# Altium project Electronics Multi Oscillator.PrjPcb
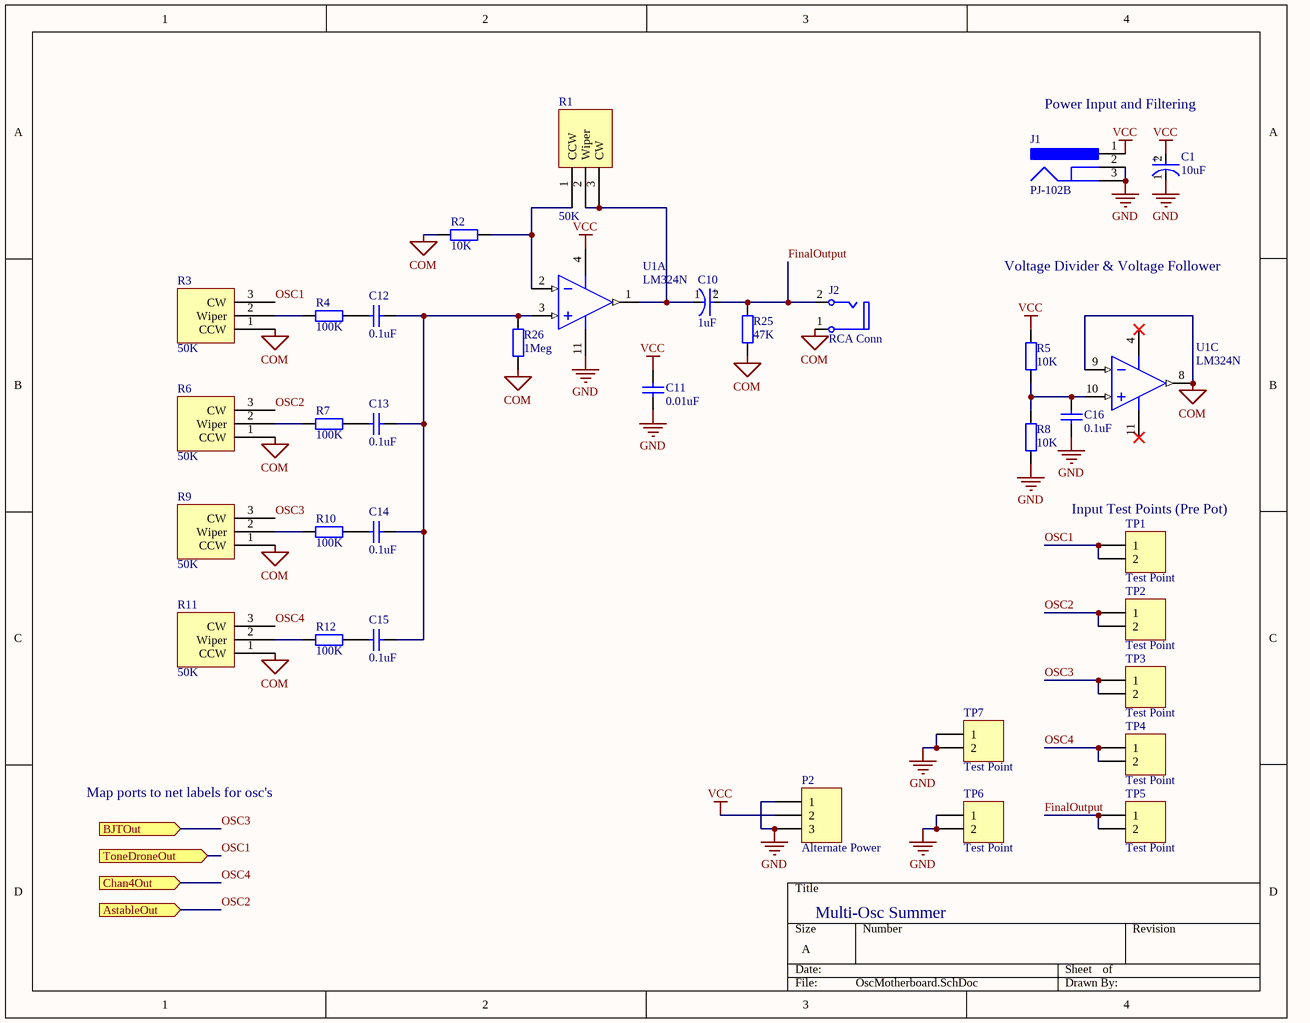
[diagram p0: OscMotherboard.SchDoc]
5 sheets, 63 parts. Net scope: flat (ports and power ports of the same name join across sheets).
Board files: MultiOsc.PcbDoc, MilledPCB.PcbDoc, FinalPCB.PcbDoc
Sheets:
  OscMotherboard.SchDoc
  ToneDroneOsc.SchDoc
  AstableMultivibrator.SchDoc
  BjtPhaseShiftOsc.SchDoc
  PerfBoard.SchDoc

## Sheet OscMotherboard.SchDoc
size A; SheetNumber: 1; SheetTotal: 5

### Parts
C1  10uF  [FP-ESLE3-MFG]
C10  1uF  [FP-ESLE3-MFG]
C11  0.01uF  [KEMT-C315-THT-2]
C12  0.1uF  [KEMT-C315-THT-2]
C13  0.1uF  [KEMT-C315-THT-2]
C14  0.1uF  [KEMT-C315-THT-2]
C15  0.1uF  [KEMT-C315-THT-2]
C16  0.1uF  [KEMT-C315-THT-2]
J1  PJ-102B  [CUI-PJ-102B_V]
J2  RCA Conn  [CUI-RCJ-041_V]
P2  Alternate Power  [HDR1X3]
R1  50K  [TrimmerPot]
R2  10K  [AXIAL-0.4]
R3  50K  [TrimmerPot]
R4  100K  [AXIAL-0.4]
R5  10K  [AXIAL-0.4]
R6  50K  [TrimmerPot]
R7  100K  [AXIAL-0.4]
R8  10K  [AXIAL-0.4]
R9  50K  [TrimmerPot]
R10  100K  [AXIAL-0.4]
R11  50K  [TrimmerPot]
R12  100K  [AXIAL-0.4]
R25  47K  [AXIAL-0.4]
R26  1Meg  [AXIAL-0.4]
TP1  Test Point  [HDR1X2]
TP2  Test Point  [HDR1X2]
TP3  Test Point  [HDR1X2]
TP4  Test Point  [HDR1X2]
TP5  Test Point  [HDR1X2]
TP6  Test Point  [HDR1X2]
TP7  Test Point  [HDR1X2]
U1  LM324N  [N0014A]  (parts A,C of 4)

### Ports
AstableOut (in), BJTOut (in), Chan4Out (in), ToneDroneOut (in)

### Nets
COM: J2.1 R2.2 R3.1(CCW) R6.1(CCW) R9.1(CCW) R11.1(CCW) R25.2 R26.2 U1.8(OUT3) U1.9(IN3-)
GND: C1.1(C) C11.2 C16.2 J1.2 J1.3 P2.1 P2.3 R8.2 TP6.1 TP6.2 TP7.1 TP7.2 U1.11(GND)
VCC: C1.2(A) C11.1 J1.1 P2.2 R5.1 U1.4(V+)
FinalOutput: C10.2(A) J2.2 R25.1 TP5.1 TP5.2
OSC1: R3.3(CW) TP1.1 TP1.2 ; port ToneDroneOut
OSC2: R6.3(CW) TP2.1 TP2.2 ; port AstableOut
OSC3: R9.3(CW) TP3.1 TP3.2 ; port BJTOut
OSC4: R11.3(CW) TP4.1 TP4.2 ; port Chan4Out
NetC10_1: C10.1(C) R1.2(Wiper) R1.3(CW) U1.1(OUT1)
NetC12_1: C12.1 C13.1 C14.1 C15.1 R26.1 U1.3(IN1+)
NetC12_2: C12.2 R4.1
NetC13_2: C13.2 R7.1
NetC14_2: C14.2 R10.1
NetC15_2: C15.2 R12.1
NetC16_1: C16.1 R5.2 R8.1 U1.10(IN3+)
NetR1_1: R1.1(CCW) R2.1 U1.2(IN1-)
NetR3_2: R3.2(Wiper) R4.2
NetR6_2: R6.2(Wiper) R7.2
NetR9_2: R9.2(Wiper) R10.2
NetR11_2: R11.2(Wiper) R12.2

### Notes on the sheet
- Power Input and Filtering
- Voltage Divider & Voltage Follower
- (near TP1) Input Test Points (Pre Pot)
- Map ports to net labels for osc's
- Multi-Osc Summer
- (in symbol CMP-03015-000004-1) +

### Library data of the parts
C1 C10 = CMP-03015-000004-1: CAP ALUM 10UF 20% 100V THRU HOLE; Manufacturer Part Number: ESL106M100AE3AA; Manufacturer: kemet; Life: 10000Hours; Ripple Current: 280mA; Dissipation Factor: 9%; Esr: 0.68Ω; Leakage Current: 10uA; Material: Aluminum; Tolerance: 20%; Voltage Rating: 100V; Device Class L3: Aluminum Electrolytic Capacitors; Value: 10uF; Height: 12.5mm; Temperature Range High: +105°C; Capacitance: 10uF; ComponentLink2Description: Datasheet; Mouser Description: Cap, 10UF, 100V, Alu Elec, Radial; Category: Cap; Octopart: https://octopart.com/esl106m100ae3aa-kemet-84758885; Temperature: -40°C to +105°C; RoHS: TRUE; Device Class L1: Passive Components; Digikey Description: CAP ALUM 10UF 20% 100V THRU HOLE; ComponentLink2URL: https://content.kemet.com/datasheets/KEM_A4074_ESL.pdf; Device Class L2: Capacitors; Temperature Range Low: -40°C; Package: ESLE3; Automotive: No; Lead Free: Yes
C11-C16 = CMP-1664-00007-1: Capacitor, Ceramic, 0.01 uF, +/- 10%, 100 V, X7R, -55 to 125 degC, 2-Pin THD, RoHS, Bulk; Output Voltage: 70 V; Case\Package: PDIP; Forward Current: 60 mA; Nominal Vf: 1.3 V; Forward Voltage: 1.5 V; Channels: 2; Max Power Dissipation: 400 mW; Vce Max: 500 mV; ComponentLink1Description: Manufacturer URL; ComponentLink2Description: Datasheet; Packaging: Rail/Tube; RoHSCompliant: true; Package Quantity: 2000; PackageReference: C315-THT-2; Min Operating Temperature: -55 degC; Max Operating Temperature: 100 degC; Radiation Hardening: No; ComponentLink1URL: http://www.kemet.com/; DatasheetVersion: Aug-16; Pins: 16; PackageDescription: 2-Pin Through Hole Device, Body 3.81 x 2.54 mm; REACH SVHC: Unknown; Mount: Through Hole; ComponentLink2URL: http://capacitoredge.kemet.com/capedge2/DataSheet/Datasheet-C315C103K1R5TA.pdf?pn=C315C103K1R5TA{BULK}
J1 = CMP-2000-06900-1: Through Hole Right Angle DC Power Jack, 2.5 A, 2.5 mm Center Pin, 3 Position, -25 to 85 degC, RoHS, Bulk; Manufacturer: CUIInc.; Insulation Resistance: 100MOhms; Inside Contact Diameter: 2.5mm; Outside Contact Diameter: 6.5mm; Voltage Rating: 24V; Current Rating: 2.5A; Brand: CUI; Datasheet URL: http://www.cui.com/product/resource/pj-102b.pdf; Housing Material: PolybutyleneTerephthalate(PBT); Operating Temperature Range: -25Cto+85C; Package Reference: PJ-102B; Factory Pack Quantity: 280; RoHS: True; Contact Material: Copper; Datasheet Version: Rev. 1.03, 04/2016; Product: Jacks; Mounting Angle: Right; Mounting Style: ThroughHole; Flammability Rating: UL94V-0; Product Category: DCPowerConnectors; Contact Gender: Male; Termination Style: ThroughHole; Manufacturer URL: http://www.cui.com/; Mounting Technology: ThroughHole; Package Description: 3-Pin Through Hole Device, Body 14.4 x 9 mm, Height 11 mm; Contact Plating: Nickel; Packaging: Bulk; Connector Type: DCPowerJack
J2 = CMP-1692-00002-1: Female RCJ Jack, 2 Position, Height 11.724 mm, Tail Length 4 mm, RoHS, Bulk; Case\Package: Metal; Connector Type: HDMI; Current Rating: 500 mA; Voltage Rating: 40 V; Length: 16.2 mm; Pins: 19; ComponentLink1URL: http://www.cui.com/; ComponentLink1Description: Manufacturer URL; Packaging: Tape and Reel; Lead Pitch: 0.5 mm; PackageDescription: Female RCJ Jack, 2 Position, Height 11.724 mm, Tail Length 4 mm; RoHSCompliant: true; Min Operating Temperature: -55 degC; Height: 6.1 mm; Contact Material: Copper; REACH SVHC: No SVHC; DatasheetVersion: Rev. B, 02/2012; ComponentLink2Description: Datasheet; Contact Plating: Gold; Colour: Black; Max Operating Temperature: 85 degC; Mount: Surface Mount; Package Quantity: 400; Gender: Female; ComponentLink2URL: http://www.cui.com/product/resource/rcj-04x.pdf; PackageReference: RCJ-041
P2 = Header 3: Header, 3-Pin; LatestRevisionDate: 17-Jul-2002; LatestRevisionNote: Re-released for DXP Platform.; Publisher: Altium Limited
R1 R3 R6 R9 R11 = TrimmerPot
R2 R4 R5 R7 R8 R10 R12 R25 R26 = Res2: Resistor; Value: 1K; Published: 8-Jun-2000; LatestRevisionDate: 17-Jul-2002; LatestRevisionNote: Re-released for DXP Platform.; PackageReference: AXIAL-0.4; Publisher: Altium Limited; PackageDescription: Axial Device, Thru-Hole; 2 Leads; 0.4 in Pin Spacing
TP1-TP7 = Header 2: Header, 2-Pin; LatestRevisionDate: 17-Jul-2002; LatestRevisionNote: Re-released for DXP Platform.; Publisher: Altium Limited
U1 = CMP-0055-00082-3: Low Power Quad Operational Amplifier, 14-pin MDIP; Manufacturer: Texas Instruments; CompType: Amplifiers; PowerWise: N; PackageTopMarking: NSUZXYYTTE#*LM324N; PackageDescription: MDIP, .750 x .250 x.130in, 14 Lead, .100in Pitch; Package Reference: N0014A; RoHS: N; Code_JEDEC: MS-001-AA; ComponentLink1URL: http://www.ti.com/general/docs/lit/getliterature.tsp?genericPartNumber=LM324&fileType=pdf; ComponentLink1Description: Datasheet URL; PinCount: 14

## Sheet ToneDroneOsc.SchDoc
size A; SheetNumber: 2; SheetTotal: 5
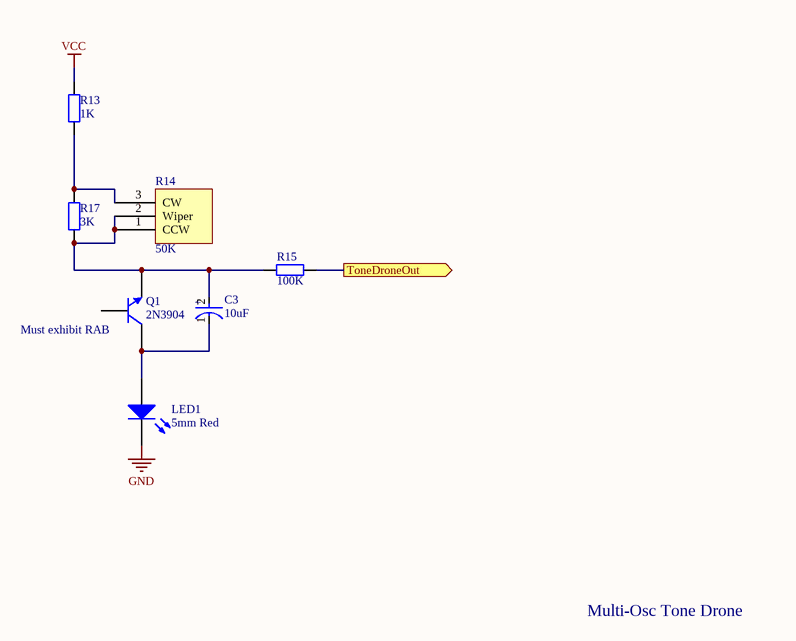
[diagram p1: ToneDroneOsc.SchDoc]

### Parts
C3  10uF  [FP-ESLE3-MFG]
LED1  5mm Red  [Type 5mm]
Q1  2N3904  [TO-92A]
R13  1K  [AXIAL-0.4]
R14  50K  [TrimmerPot]
R15  100K  [AXIAL-0.4]
R17  3K  [AXIAL-0.4]

### Ports
ToneDroneOut (out)

### Nets
GND: LED1.1(K)
VCC: R13.2
OSC1: R15.1 ; port ToneDroneOut
NetC3_1: C3.1(C) LED1.2(A) Q1.3(C)
NetC3_2: C3.2(A) Q1.1(E) R14.1(CCW) R14.2(Wiper) R15.2 R17.1
NetR13_1: R13.1 R14.3(CW) R17.2

Not connected (* = marked no-connect by the designer): Q1 2(B)

### Notes on the sheet
- (near Q1) Must exhibit RAB
- Multi-Osc Tone Drone
- (in symbol CMP-03015-000004-1) +

### Library data of the parts
C3 = CMP-03015-000004-1: as C1 on sheet OscMotherboard; Tolerance: 20%; Voltage Rating: 100V; Device Class L3: Aluminum Electrolytic Capacitors; Value: 10uF; Height: 12.5mm; Temperature Range High: +105°C; Capacitance: 10uF; ComponentLink2Description: Datasheet; Mouser Description: Cap, 10UF, 100V, Alu Elec, Radial; Category: Cap; Octopart: https://octopart.com/esl106m100ae3aa-kemet-84758885; Temperature: -40°C to +105°C; RoHS: TRUE; Device Class L1: Passive Components; Digikey Description: CAP ALUM 10UF 20% 100V THRU HOLE; ComponentLink2URL: https://content.kemet.com/datasheets/KEM_A4074_ESL.pdf; Device Class L2: Capacitors; Temperature Range Low: -40°C; Package: ESLE3; Automotive: No; Lead Free: Yes
LED1 = CMP-1488-00008-1: THT LED round mono-color color lens, WL-TMRW, Red; PartNumber: 151051RS11000; Manufacturer: Wuerth Elektronik; PackageReference: Type 5mm; ComponentLink2URL: http://katalog.we-online.de/pbs/datasheet/7448042001.pdfhttp://katalog.we-online.de/pbs/datasheet/7448042001.pdfhttp://katalog.we-online.de/pbs/datasheet/7448042001.pdfhttp://katalog.we-online.de/pbs/datasheet/151051RS11000.pdf; ComponentLink1URL: http://www.we-online.com; ComponentLink1Description: Manufacturer URL; ComponentLink2Description: Datasheet; Emitting color: Red
Q1 = 2N3904: NPN General Purpose Amplifier; Published: 8-Jun-2000; LatestRevisionDate: 15-Jan-2003; LatestRevisionNote: PCB Footprint 'BCY-W3/D4.7' replaced; DatasheetVersion: 1997; PackageVersion: Sep-1998; PackageReference: TO-92A; Publisher: Altium Limited; PackageDescription: TO, Flat Index; 3 In-Line, Axial Leads; Body Dia. 4.5mm; Leads 0.51 x 0.48 mm (max); ComponentLink1Description: Manufacturer Link; ComponentLink1URL: http://www.fairchildsemi.com/; ComponentLink2Description: Datasheet; ComponentLink2URL: http://www.fairchildsemi.com/ds/2N%2F2N3904.pdf
R13 R15 = Res2: Resistor; Published: 8-Jun-2000; LatestRevisionDate: 17-Jul-2002; LatestRevisionNote: Re-released for DXP Platform.; PackageReference: AXIAL-0.4; Publisher: Altium Limited; PackageDescription: Axial Device, Thru-Hole; 2 Leads; 0.4 in Pin Spacing
  R13: Value: 1K
  R15: Value: 100K
R14 = TrimmerPot
R17 = Res2: Resistor; Value: 1K; Published: 8-Jun-2000; LatestRevisionDate: 17-Jul-2002; LatestRevisionNote: Re-released for DXP Platform.; PackageReference: AXIAL-0.4; Publisher: Altium Limited; PackageDescription: Axial Device, Thru-Hole; 2 Leads; 0.4 in Pin Spacing

## Sheet AstableMultivibrator.SchDoc
size A; SheetNumber: 3; SheetTotal: 5
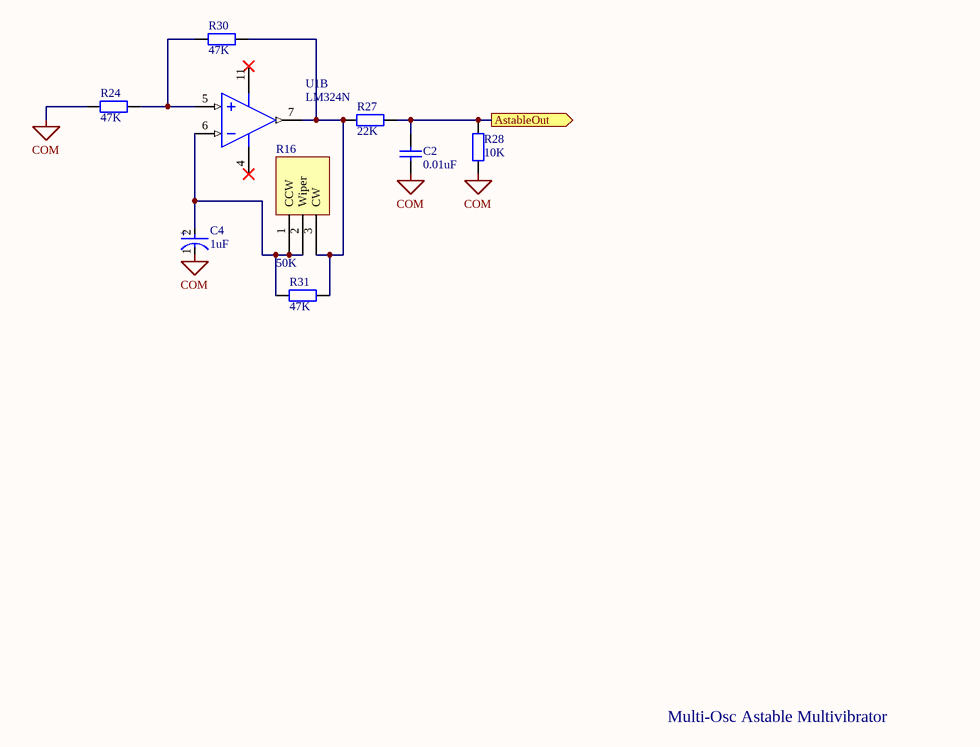
[diagram p2: AstableMultivibrator.SchDoc]

### Parts
C2  0.01uF  [KEMT-C315-THT-2]
C4  1uF  [FP-ESLE3-MFG]
R16  50K  [TrimmerPot]
R24  47K  [AXIAL-0.4]
R27  22K  [AXIAL-0.4]
R28  10K  [AXIAL-0.4]
R30  47K  [AXIAL-0.4]
R31  47K  [AXIAL-0.4]
U1  LM324N  [N0014A]  (part B of 4)

### Ports
AstableOut (out)

### Nets
COM: C2.2 C4.1(C) R24.1 R28.2
GND: U1.11(GND)
VCC: U1.4(V+)
OSC2: C2.1 R27.2 R28.1 ; port AstableOut
NetC4_2: C4.2(A) R16.1(CCW) R16.2(Wiper) R31.2 U1.6(IN2-)
NetR16_3: R16.3(CW) R27.1 R30.1 R31.1 U1.7(OUT2)
NetR24_2: R24.2 R30.2 U1.5(IN2+)

### Notes on the sheet
- Multi-Osc Astable Multivibrator
- (in symbol CMP-03015-000004-1) +

### Library data of the parts
C2 = CMP-1664-00007-1: as C11 on sheet OscMotherboard; ComponentLink1Description: Manufacturer URL; ComponentLink2Description: Datasheet; Packaging: Rail/Tube; RoHSCompliant: true; Package Quantity: 2000; PackageReference: C315-THT-2; Min Operating Temperature: -55 degC; Max Operating Temperature: 100 degC; Radiation Hardening: No; ComponentLink1URL: http://www.kemet.com/; DatasheetVersion: Aug-16; Pins: 16; PackageDescription: 2-Pin Through Hole Device, Body 3.81 x 2.54 mm; REACH SVHC: Unknown; Mount: Through Hole; ComponentLink2URL: http://capacitoredge.kemet.com/capedge2/DataSheet/Datasheet-C315C103K1R5TA.pdf?pn=C315C103K1R5TA{BULK}
C4 = CMP-03015-000004-1: as C1 on sheet OscMotherboard; Tolerance: 20%; Voltage Rating: 100V; Device Class L3: Aluminum Electrolytic Capacitors; Value: 10uF; Height: 12.5mm; Temperature Range High: +105°C; Capacitance: 10uF; ComponentLink2Description: Datasheet; Mouser Description: Cap, 10UF, 100V, Alu Elec, Radial; Category: Cap; Octopart: https://octopart.com/esl106m100ae3aa-kemet-84758885; Temperature: -40°C to +105°C; RoHS: TRUE; Device Class L1: Passive Components; Digikey Description: CAP ALUM 10UF 20% 100V THRU HOLE; ComponentLink2URL: https://content.kemet.com/datasheets/KEM_A4074_ESL.pdf; Device Class L2: Capacitors; Temperature Range Low: -40°C; Package: ESLE3; Automotive: No; Lead Free: Yes
R16 = TrimmerPot
R24 R27 R28 R30 R31 = Res2: Resistor; Value: 1K; Published: 8-Jun-2000; LatestRevisionDate: 17-Jul-2002; LatestRevisionNote: Re-released for DXP Platform.; PackageReference: AXIAL-0.4; Publisher: Altium Limited; PackageDescription: Axial Device, Thru-Hole; 2 Leads; 0.4 in Pin Spacing
U1 = CMP-0055-00082-3: as U1 on sheet OscMotherboard; PackageDescription: MDIP, .750 x .250 x.130in, 14 Lead, .100in Pitch; Package Reference: N0014A; RoHS: N; Code_JEDEC: MS-001-AA; ComponentLink1URL: http://www.ti.com/general/docs/lit/getliterature.tsp?genericPartNumber=LM324&fileType=pdf; ComponentLink1Description: Datasheet URL; PinCount: 14

## Sheet BjtPhaseShiftOsc.SchDoc
size A; SheetNumber: 4; SheetTotal: 5
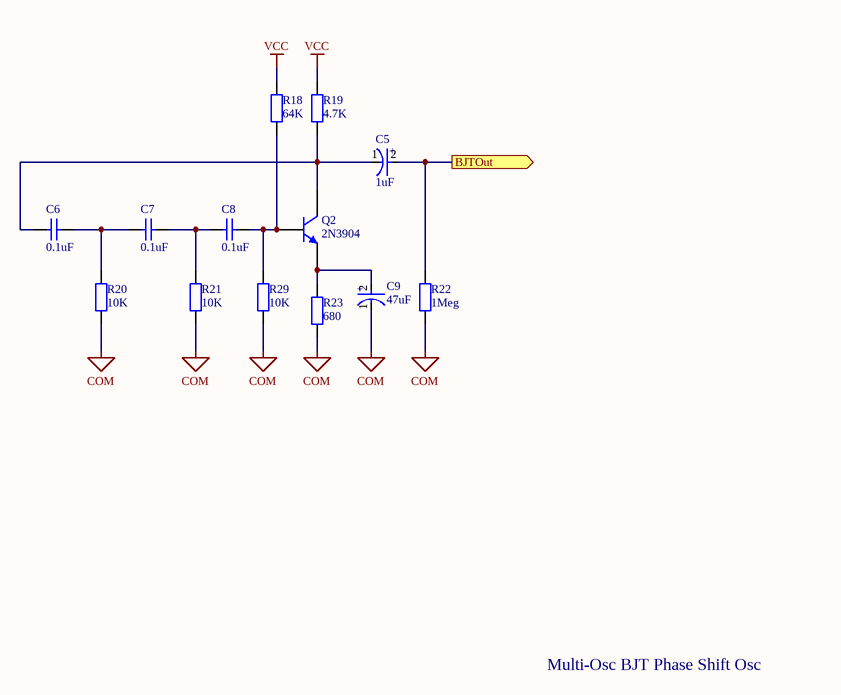
[diagram p3: BjtPhaseShiftOsc.SchDoc]

### Parts
C5  1uF  [FP-ESLE3-MFG]
C6  0.1uF  [KEMT-C315-THT-2]
C7  0.1uF  [KEMT-C315-THT-2]
C8  0.1uF  [KEMT-C315-THT-2]
C9  47uF  [FP-ESLE3-MFG]
Q2  2N3904  [TO-92A]
R18  64K  [AXIAL-0.4]
R19  4.7K  [AXIAL-0.4]
R20  10K  [AXIAL-0.4]
R21  10K  [AXIAL-0.4]
R22  1Meg  [AXIAL-0.4]
R23  680  [AXIAL-0.4]
R29  10K  [AXIAL-0.4]

### Ports
BJTOut (out)

### Nets
COM: C9.1(C) R20.2 R21.2 R22.2 R23.2 R29.2
VCC: R18.2 R19.1
OSC3: C5.2(A) R22.1 ; port BJTOut
NetC5_1: C5.1(C) C6.2 Q2.3(C) R19.2
NetC6_1: C6.1 C7.2 R20.1
NetC7_1: C7.1 C8.1 R21.1
NetC8_2: C8.2 Q2.2(B) R18.1 R29.1
NetC9_2: C9.2(A) Q2.1(E) R23.1

### Notes on the sheet
- Multi-Osc BJT Phase Shift Osc
- (in symbol CMP-03015-000004-1) +

### Library data of the parts
C5 C9 = CMP-03015-000004-1: as C1 on sheet OscMotherboard; Tolerance: 20%; Voltage Rating: 100V; Device Class L3: Aluminum Electrolytic Capacitors; Value: 10uF; Height: 12.5mm; Temperature Range High: +105°C; Capacitance: 10uF; ComponentLink2Description: Datasheet; Mouser Description: Cap, 10UF, 100V, Alu Elec, Radial; Category: Cap; Octopart: https://octopart.com/esl106m100ae3aa-kemet-84758885; Temperature: -40°C to +105°C; RoHS: TRUE; Device Class L1: Passive Components; Digikey Description: CAP ALUM 10UF 20% 100V THRU HOLE; ComponentLink2URL: https://content.kemet.com/datasheets/KEM_A4074_ESL.pdf; Device Class L2: Capacitors; Temperature Range Low: -40°C; Package: ESLE3; Automotive: No; Lead Free: Yes
C6-C8 = CMP-1664-00007-1: as C11 on sheet OscMotherboard; ComponentLink1Description: Manufacturer URL; ComponentLink2Description: Datasheet; Packaging: Rail/Tube; RoHSCompliant: true; Package Quantity: 2000; PackageReference: C315-THT-2; Min Operating Temperature: -55 degC; Max Operating Temperature: 100 degC; Radiation Hardening: No; ComponentLink1URL: http://www.kemet.com/; DatasheetVersion: Aug-16; Pins: 16; PackageDescription: 2-Pin Through Hole Device, Body 3.81 x 2.54 mm; REACH SVHC: Unknown; Mount: Through Hole; ComponentLink2URL: http://capacitoredge.kemet.com/capedge2/DataSheet/Datasheet-C315C103K1R5TA.pdf?pn=C315C103K1R5TA{BULK}
Q2 = 2N3904: NPN General Purpose Amplifier; Published: 8-Jun-2000; LatestRevisionDate: 15-Jan-2003; LatestRevisionNote: PCB Footprint 'BCY-W3/D4.7' replaced; DatasheetVersion: 1997; PackageVersion: Sep-1998; PackageReference: TO-92A; Publisher: Altium Limited; PackageDescription: TO, Flat Index; 3 In-Line, Axial Leads; Body Dia. 4.5mm; Leads 0.51 x 0.48 mm (max); ComponentLink1Description: Manufacturer Link; ComponentLink1URL: http://www.fairchildsemi.com/; ComponentLink2Description: Datasheet; ComponentLink2URL: http://www.fairchildsemi.com/ds/2N%2F2N3904.pdf
R18 R20-R23 R29 = Res2: Resistor; Published: 8-Jun-2000; LatestRevisionDate: 17-Jul-2002; LatestRevisionNote: Re-released for DXP Platform.; PackageReference: AXIAL-0.4; Publisher: Altium Limited; PackageDescription: Axial Device, Thru-Hole; 2 Leads; 0.4 in Pin Spacing
  R18: Value: 64K
  R20 R21 R29: Value: 10K
  R22: Value: 1Meg
  R23: Value: 680
R19 = Res2: Resistor; Value: 1K; Published: 8-Jun-2000; LatestRevisionDate: 17-Jul-2002; LatestRevisionNote: Re-released for DXP Platform.; PackageReference: AXIAL-0.4; Publisher: Altium Limited; PackageDescription: Axial Device, Thru-Hole; 2 Leads; 0.4 in Pin Spacing

## Sheet PerfBoard.SchDoc
size A; SheetNumber: 5; SheetTotal: 5
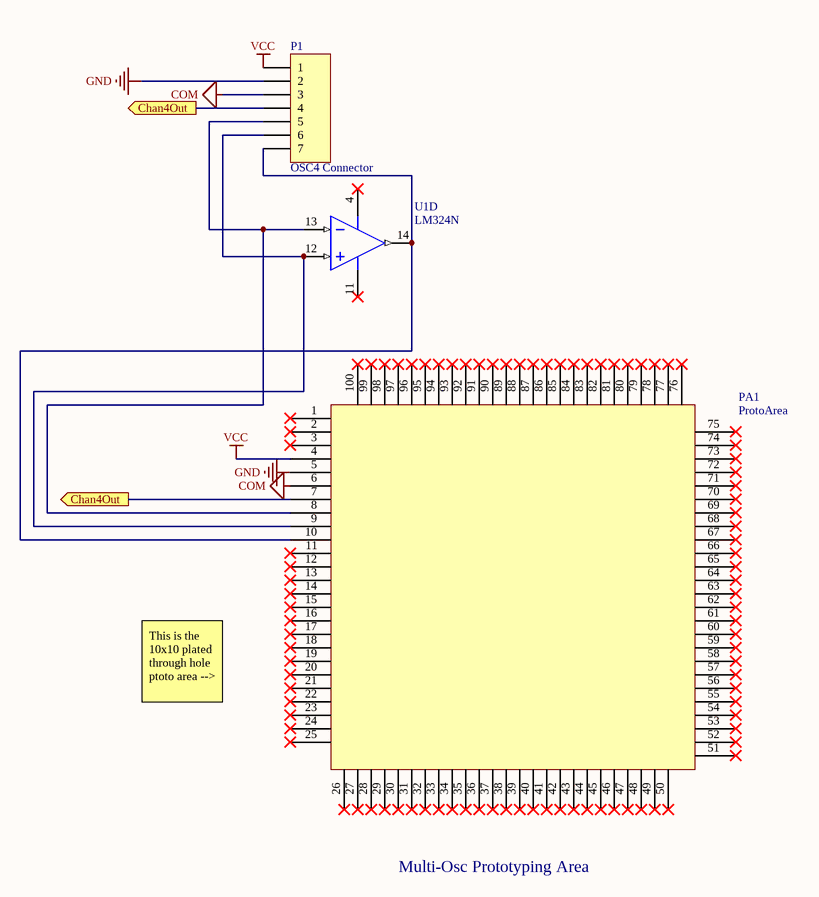
[diagram p4: PerfBoard.SchDoc]

### Parts
P1  OSC4 Connector  [HDR1X7]
PA1  ProtoArea  [ProtoArea]  (no BOM)
U1  LM324N  [N0014A]  (part D of 4)

### Ports
Chan4Out (out)

### Nets
COM: P1.3 PA1.6
GND: P1.2 PA1.5 U1.11(GND)
VCC: P1.1 PA1.4 U1.4(V+)
OSC4: P1.4 PA1.7 ; port Chan4Out
NetP1_5: P1.5 PA1.8 U1.13(IN4-)
NetP1_6: P1.6 PA1.9 U1.12(IN4+)
NetP1_7: P1.7 PA1.10 U1.14(OUT4)

Not connected (* = marked no-connect by the designer): PA1 1* 2* 3* 11* 12* 13* 14* 15* 16* 17* 18* 19* 20* 21* 22* 23* 24* 25* 26* 27* 28* 29* 30* 31* 32* 33* 34* 35* 36* 37* 38* 39* 40* 41* 42* 43* 44* 45* 46* 47* 48* 49* 50* 51* 52* 53* 54* 55* 56* 57* 58* 59* 60* 61* 62* 63* 64* 65* 66* 67* 68* 69* 70* 71* 72* 73* 74* 75* 76* 77* 78* 79* 80* 81* 82* 83* 84* 85* 86* 87* 88* 89* 90* 91* 92* 93* 94* 95* 96* 97* 98* 99* 100*

### Notes on the sheet
- This is the 10x10 plated through hole ptoto area -->
- Multi-Osc Prototyping Area

### Library data of the parts
P1 = Header 7: Header, 7-Pin; LatestRevisionDate: 17-Jul-2002; LatestRevisionNote: Re-released for DXP Platform.; Publisher: Altium Limited
PA1 = PerfBoard
U1 = CMP-0055-00082-3: as U1 on sheet OscMotherboard; PackageDescription: MDIP, .750 x .250 x.130in, 14 Lead, .100in Pitch; Package Reference: N0014A; RoHS: N; Code_JEDEC: MS-001-AA; ComponentLink1URL: http://www.ti.com/general/docs/lit/getliterature.tsp?genericPartNumber=LM324&fileType=pdf; ComponentLink1Description: Datasheet URL; PinCount: 14

## Nets that join several sheets
COM: OscMotherboard (10 pins), AstableMultivibrator (C2.2 C4.1 R24.1 R28.2), BjtPhaseShiftOsc (6 pins), PerfBoard (P1.3 PA1.6)
GND: OscMotherboard (13 pins), ToneDroneOsc (LED1.1), AstableMultivibrator (U1.11), PerfBoard (P1.2 PA1.5 U1.11)
VCC: OscMotherboard (6 pins), ToneDroneOsc (R13.2), AstableMultivibrator (U1.4), BjtPhaseShiftOsc (R18.2 R19.1), PerfBoard (P1.1 PA1.4 U1.4)
OSC1: OscMotherboard (R3.3 TP1.1 TP1.2), ToneDroneOsc (R15.1)
OSC2: OscMotherboard (R6.3 TP2.1 TP2.2), AstableMultivibrator (C2.1 R27.2 R28.1)
OSC3: OscMotherboard (R9.3 TP3.1 TP3.2), BjtPhaseShiftOsc (C5.2 R22.1)
OSC4: OscMotherboard (R11.3 TP4.1 TP4.2), PerfBoard (P1.4 PA1.7)